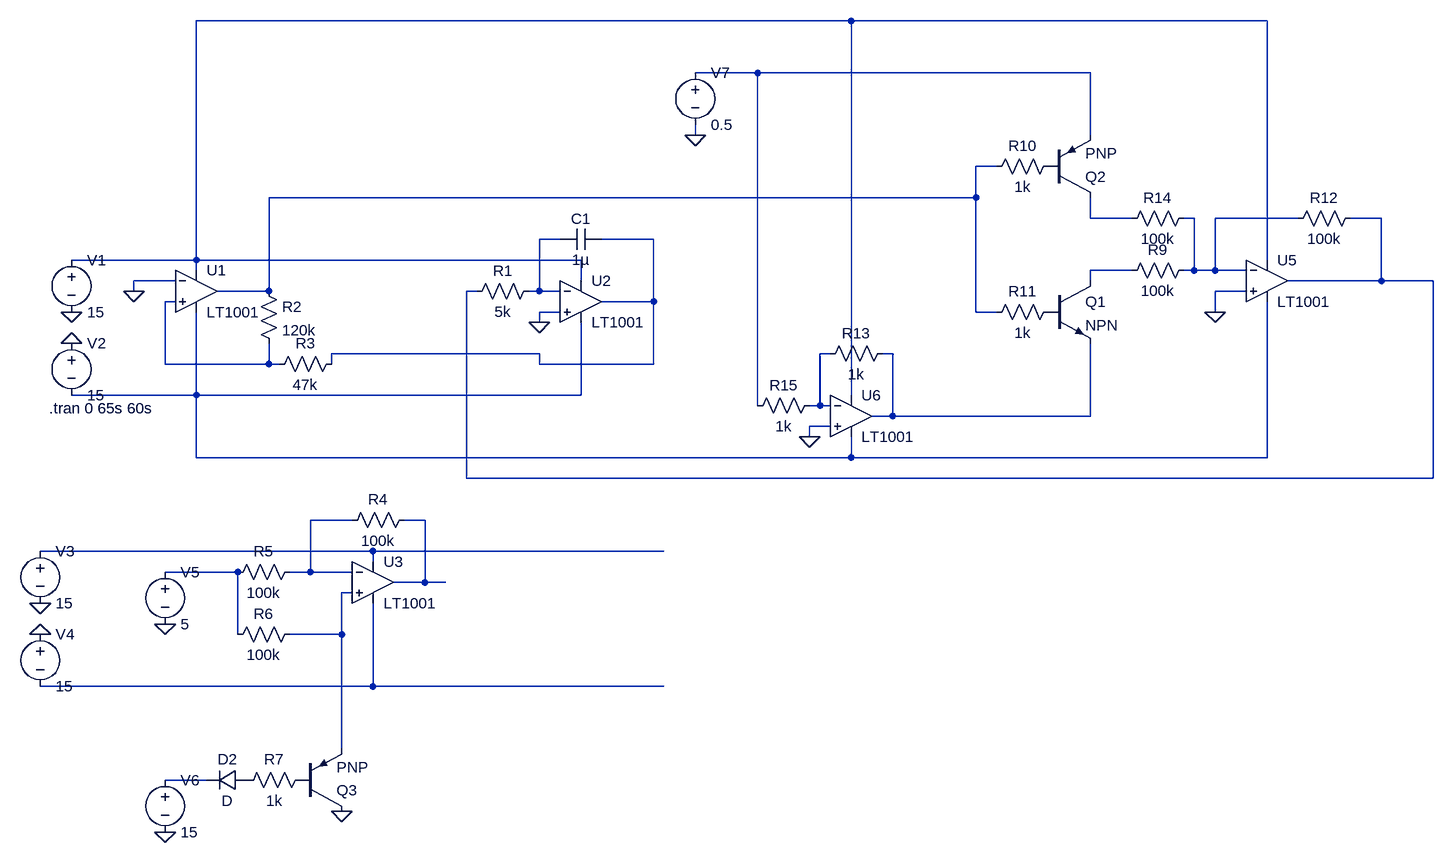
[diagram p0: schematic Supersaw-with-cv-2.asc]
Supersaw-with-cv-2.asc, the LTspice schematic file:
Version 4
SHEET 1 1540 1012
WIRE 512 -256 -496 -256
WIRE 1152 -256 512 -256
WIRE 368 -176 272 -176
WIRE 880 -176 368 -176
WIRE 272 -80 272 -96
WIRE 880 -80 880 -176
WIRE 736 -32 704 -32
WIRE 704 16 704 -32
WIRE 704 16 -384 16
WIRE 880 48 880 16
WIRE 944 48 880 48
WIRE 1040 48 1024 48
WIRE 1200 48 1072 48
WIRE 1328 48 1280 48
WIRE 64 80 32 80
WIRE 208 80 128 80
WIRE -496 112 -496 -256
WIRE -496 112 -688 112
WIRE 96 112 -496 112
WIRE 1152 112 1152 -256
WIRE -496 128 -496 112
WIRE 944 128 880 128
WIRE 1040 128 1040 48
WIRE 1040 128 1024 128
WIRE 1072 128 1072 48
WIRE 1072 128 1040 128
WIRE 1120 128 1072 128
WIRE -528 144 -592 144
WIRE 96 144 96 112
WIRE 880 144 880 128
WIRE 1328 144 1328 48
WIRE 1328 144 1184 144
WIRE 1408 144 1328 144
WIRE -592 160 -592 144
WIRE -384 160 -384 16
WIRE -384 160 -464 160
WIRE -64 160 -80 160
WIRE 32 160 32 80
WIRE 32 160 16 160
WIRE 64 160 32 160
WIRE 1120 160 1072 160
WIRE -528 176 -544 176
WIRE 208 176 208 80
WIRE 208 176 128 176
WIRE 64 192 32 192
WIRE 704 192 704 16
WIRE 736 192 704 192
WIRE 1072 192 1072 160
WIRE 32 208 32 192
WIRE 32 256 -288 256
WIRE 480 256 464 256
WIRE 576 256 560 256
WIRE -544 272 -544 176
WIRE -384 272 -384 240
WIRE -384 272 -544 272
WIRE -368 272 -384 272
WIRE -288 272 -288 256
WIRE 32 272 32 256
WIRE 208 272 208 176
WIRE 208 272 32 272
WIRE -496 320 -496 192
WIRE -496 320 -688 320
WIRE 96 320 96 208
WIRE 96 320 -496 320
WIRE 512 320 512 -256
WIRE 368 336 368 -176
WIRE 464 336 464 256
WIRE 464 336 448 336
WIRE 480 336 464 336
WIRE 576 352 576 256
WIRE 576 352 544 352
WIRE 880 352 880 240
WIRE 880 352 576 352
WIRE 480 368 448 368
WIRE 448 384 448 368
WIRE -496 416 -496 320
WIRE 512 416 512 384
WIRE 512 416 -496 416
WIRE 1152 416 1152 176
WIRE 1152 416 512 416
WIRE -80 448 -80 160
WIRE 1408 448 1408 144
WIRE 1408 448 -80 448
WIRE -256 512 -320 512
WIRE -144 512 -176 512
WIRE -224 560 -736 560
WIRE 224 560 -224 560
WIRE -224 576 -224 560
WIRE -432 592 -544 592
WIRE -320 592 -320 512
WIRE -320 592 -352 592
WIRE -256 592 -320 592
WIRE -144 608 -144 512
WIRE -144 608 -192 608
WIRE -112 608 -144 608
WIRE -256 624 -272 624
WIRE -432 688 -432 592
WIRE -272 688 -272 624
WIRE -272 688 -352 688
WIRE -224 768 -224 640
WIRE -224 768 -736 768
WIRE 224 768 -224 768
WIRE -272 864 -272 688
WIRE -480 912 -544 912
FLAG -592 160 0
FLAG 32 208 0
FLAG -688 192 0
FLAG -688 240 0
FLAG -736 640 0
FLAG -736 688 0
FLAG 1072 192 0
FLAG 272 -80 0
FLAG 448 384 0
FLAG -544 672 0
FLAG -544 992 0
FLAG -272 960 0
SYMBOL Opamps\\LT1001 -496 96 R0
SYMATTR InstName U1
SYMBOL Opamps\\LT1001 96 112 R0
SYMATTR InstName U2
SYMBOL res -400 144 R0
SYMATTR InstName R2
SYMATTR Value 120k
SYMBOL res -272 256 R90
WINDOW 0 0 56 VBottom 2
WINDOW 3 32 56 VTop 2
SYMATTR InstName R3
SYMATTR Value 47k
SYMBOL cap 64 96 R270
WINDOW 0 32 32 VTop 2
WINDOW 3 0 32 VBottom 2
SYMATTR InstName C1
SYMATTR Value 1µ
SYMBOL voltage -688 96 R0
WINDOW 123 0 0 Left 2
WINDOW 39 0 0 Left 2
SYMATTR InstName V1
SYMATTR Value 15
SYMBOL voltage -688 224 R0
WINDOW 123 0 0 Left 2
WINDOW 39 0 0 Left 2
SYMATTR InstName V2
SYMATTR Value 15
SYMBOL Opamps\\LT1001 -224 544 R0
SYMATTR InstName U3
SYMBOL voltage -736 544 R0
WINDOW 123 0 0 Left 2
WINDOW 39 0 0 Left 2
SYMATTR InstName V3
SYMATTR Value 15
SYMBOL voltage -736 672 R0
WINDOW 123 0 0 Left 2
WINDOW 39 0 0 Left 2
SYMATTR InstName V4
SYMATTR Value 15
SYMBOL npn 816 144 R0
SYMATTR InstName Q1
SYMBOL res 1040 112 R90
WINDOW 0 0 56 VBottom 2
WINDOW 3 32 56 VTop 2
SYMATTR InstName R9
SYMATTR Value 100k
SYMBOL res 720 208 R270
WINDOW 0 32 56 VTop 2
WINDOW 3 0 56 VBottom 2
SYMATTR InstName R11
SYMATTR Value 1k
SYMBOL Opamps\\LT1001 1152 80 R0
SYMATTR InstName U5
SYMBOL res 1184 64 R270
WINDOW 0 32 56 VTop 2
WINDOW 3 0 56 VBottom 2
SYMATTR InstName R12
SYMATTR Value 100k
SYMBOL pnp 816 16 M180
SYMATTR InstName Q2
SYMBOL res 720 -16 R270
WINDOW 0 32 56 VTop 2
WINDOW 3 0 56 VBottom 2
SYMATTR InstName R10
SYMATTR Value 1k
SYMBOL voltage 272 -192 R0
WINDOW 123 0 0 Left 2
WINDOW 39 0 0 Left 2
SYMATTR InstName V7
SYMATTR Value 0.5
SYMBOL res 1040 32 R90
WINDOW 0 0 56 VBottom 2
WINDOW 3 32 56 VTop 2
SYMATTR InstName R14
SYMATTR Value 100k
SYMBOL Opamps\\LT1001 512 288 R0
SYMATTR InstName U6
SYMBOL res 464 272 R270
WINDOW 0 32 56 VTop 2
WINDOW 3 0 56 VBottom 2
SYMATTR InstName R13
SYMATTR Value 1k
SYMBOL res 352 352 R270
WINDOW 0 32 56 VTop 2
WINDOW 3 0 56 VBottom 2
SYMATTR InstName R15
SYMATTR Value 1k
SYMBOL res -80 176 R270
WINDOW 0 32 56 VTop 2
WINDOW 3 0 56 VBottom 2
SYMATTR InstName R1
SYMATTR Value 5k
SYMBOL res -160 496 R90
WINDOW 0 0 56 VBottom 2
WINDOW 3 32 56 VTop 2
SYMATTR InstName R4
SYMATTR Value 100k
SYMBOL res -336 576 R90
WINDOW 0 0 56 VBottom 2
WINDOW 3 32 56 VTop 2
SYMATTR InstName R5
SYMATTR Value 100k
SYMBOL res -336 672 R90
WINDOW 0 0 56 VBottom 2
WINDOW 3 32 56 VTop 2
SYMATTR InstName R6
SYMATTR Value 100k
SYMBOL voltage -544 576 R0
WINDOW 123 0 0 Left 2
WINDOW 39 0 0 Left 2
SYMATTR InstName V5
SYMATTR Value 5
SYMBOL res -432 928 R270
WINDOW 0 32 56 VTop 2
WINDOW 3 0 56 VBottom 2
SYMATTR InstName R7
SYMATTR Value 1k
SYMBOL voltage -544 896 R0
WINDOW 123 0 0 Left 2
WINDOW 39 0 0 Left 2
SYMATTR InstName V6
SYMATTR Value 15
SYMBOL pnp -336 960 M180
SYMATTR InstName Q3
SYMBOL diode -416 896 R90
WINDOW 0 0 32 VBottom 2
WINDOW 3 32 32 VTop 2
SYMATTR InstName D2
TEXT -722 340 Left 2 !.tran 0 65s 60s

The netlist it stands for:
* Supersaw-with-cv-2.asc
XU1 N010 0 N001 N013 N003 LT1001  ; pins In+ In- V+ V- OUT
XU2 0 N007 N001 N013 N008 LT1001  ; pins In+ In- V+ V- OUT
R2 N003 N010 120k
R3 N008 N010 47k
C1 N007 N008 1µ
V1 N001 0 15
V2 0 N013 15
XU3 N018 N014 N016 N019 N015 LT1001  ; pins In+ In- V+ V- OUT
V3 N016 0 15
V4 0 N019 15
Q1 N009 P001 N012 0 NPN
R9 N005 N009 100k
R11 N003 P001 1k
XU5 0 N005 N001 N013 N006 LT1001  ; pins In+ In- V+ V- OUT
R12 N005 N006 100k
Q2 N004 P002 N002 0 PNP
R10 N003 P002 1k
V7 N002 0 0.5
R14 N005 N004 100k
XU6 0 N011 N001 N013 N012 LT1001  ; pins In+ In- V+ V- OUT
R13 N011 N012 1k
R15 N002 N011 1k
R1 N006 N007 5k
R4 N015 N014 100k
R5 N014 N017 100k
R6 N018 N017 100k
V5 N017 0 5
R7 P003 P004 1k
V6 N020 0 15
Q3 0 P004 N018 0 PNP
D2 P003 N020 D
.model D D
.lib standard.dio
.model NPN NPN
.model PNP PNP
.lib standard.bjt
.tran 0 65s 60s
.lib LTC.lib
.backanno
.end